# Altium schematic sheet 03-key+led+swd.SchDoc
size A4; SheetNumber: 4; SheetTotal: 4
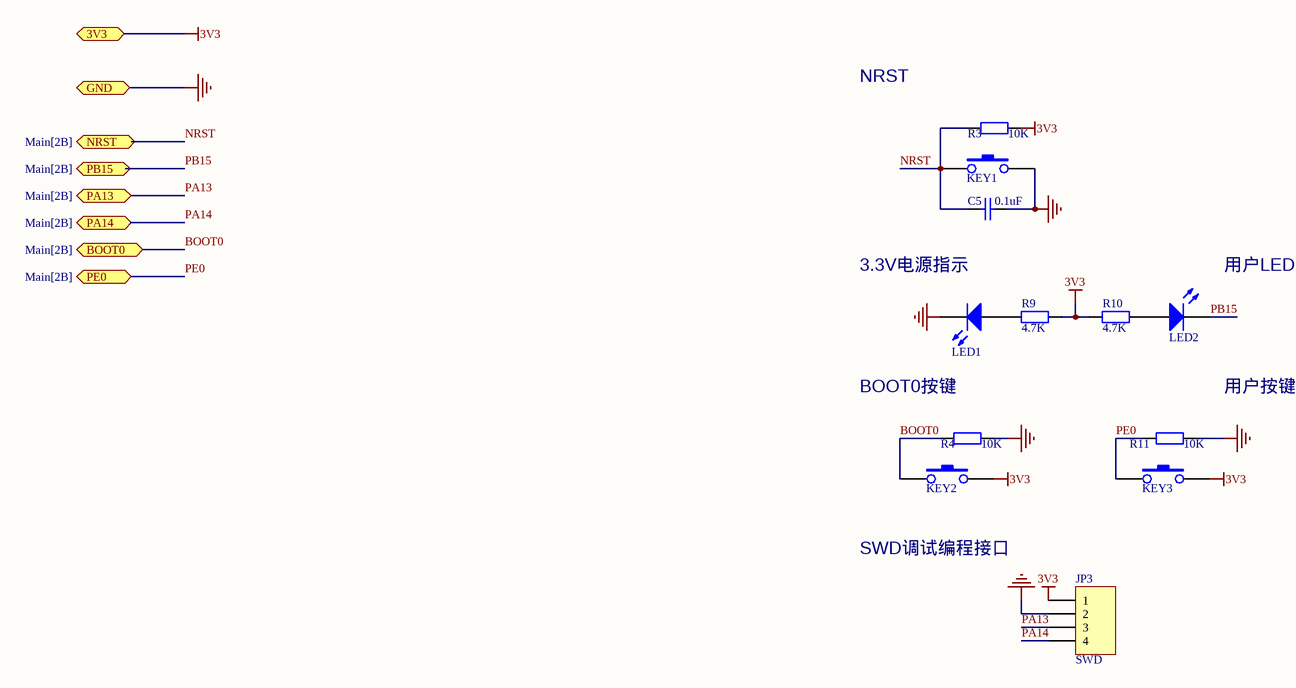
[diagram p0: 03-key+led+swd.SchDoc]

## Parts
C5  0.1uF  [C 0402_L]
JP3  SWD  [HDR2.54-WS-4P]
KEY1  KEY  [SWT3*4]  (value not drawn)
KEY2  KEY  [SWT3*4]  (value not drawn)
KEY3  KEY  [SWT3*4]  (value not drawn)
LED1  LED  [LED 0603]  (value not drawn)
LED2  LED  [LED 0603]  (value not drawn)
R3  10K  [R 0402_L]
R4  10K  [R 0402_L]
R9  4.7K  [R 0402_L]
R10  4.7K  [R 0402_L]
R11  10K  [R 0402_L]

## Ports
3V3 (bidir, see Main[2B]), BOOT0 (bidir, see Main[2B]), GND (bidir, see Main[2B]), NRST (bidir, see Main[2B]), PA13 (bidir, see Main[2B]), PA14 (bidir, see Main[2B]), PB15 (bidir, see Main[2B]), PE0 (bidir, see Main[2B])

## Nets
3V3: JP3.1 KEY2.2 KEY3.2 R3.1 R9.1 R10.1 ; port 3V3
GND: C5.1 JP3.2 KEY1.2 LED1.2(K) R4.1 R11.1 ; port GND
BOOT0: KEY2.1 R4.2 ; port BOOT0
NRST: C5.2 KEY1.1 R3.2 ; port NRST
PA13: JP3.3 ; port PA13
PA14: JP3.4 ; port PA14
PB15: LED2.2(K) ; port PB15
PE0: KEY3.1 R11.2 ; port PE0
NetLED1_1: LED1.1(A) R9.2
NetLED2_1: LED2.1(A) R10.2

## Notes on the sheet
- NRST
- 3.3V电源指示
- 用户LED
- BOOT0按键
- 用户按键
- SWD调试编程接口

## Library data of the parts
C5 = Cap
JP3 = Header 1*4: LatestRevisionDate: 17-Jul-2002; LatestRevisionNote: Re-released for DXP Platform.; Publisher: Altium Limited
R3 R4 R9-R11 = Res